# Altium schematic sheet power_cpu.SchDoc
size A3
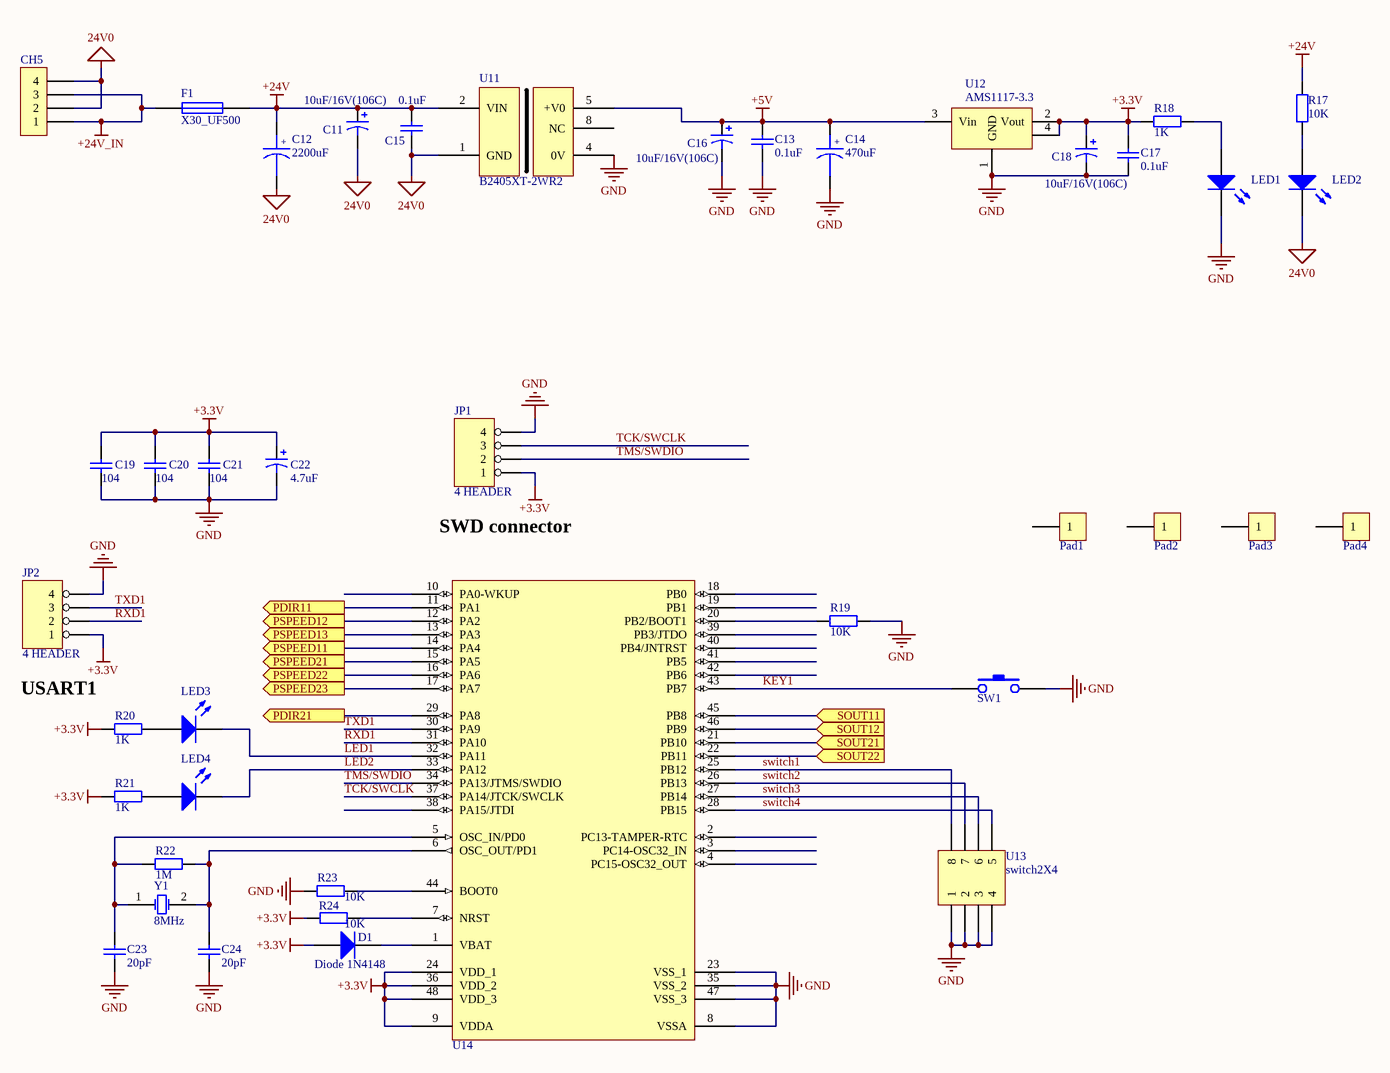
[diagram p0: power_cpu.SchDoc]

## Parts
C11  value 10uF/16V(106C)  [CAP A-3216]  (hidden comment: Cap Pol3)
C12  C_2200uF  [C7.8*17]  (value not drawn)
C13  value 0.1uF  [0805]  (hidden comment: Cap)
C14  C_2200uF  [C5*10]  (value not drawn)
C15  value 0.1uF  [0805]  (hidden comment: Cap)
C16  value 10uF/16V(106C)  [CAP A-3216]  (hidden comment: Cap Pol3)
C17  value 0.1uF  [0805]  (hidden comment: Cap)
C18  value 10uF/16V(106C)  [CAP A-3216]  (hidden comment: Cap Pol3)
C19  value 104  [C0805tan]  (hidden comment: Cap)
C20  value 104  [C0805tan]  (hidden comment: Cap)
C21  value 104  [C0805tan]  (hidden comment: Cap)
C22  value 4.7uF  [3225[1210]]  (hidden comment: Cap Pol1)
C23  value 20pF  [C0805tan]  (hidden comment: Cap)
C24  value 20pF  [C0805tan]  (hidden comment: Cap)
CH5  HEADER1X4  [CH3.96-4PIN]  (value not drawn)
D1  Diode 1N4148  [LL34]
F1  X30_UF500  [X30UF600]
JP1  4 HEADER  [CON4_1.5]
JP2  4 HEADER  [HDR1X4]
LED1  (no value)  [LED-0805]
LED2  (no value)  [LED-0805]
LED3  (no value)  [LED-0805]
LED4  (no value)  [LED-0805]
Pad1  Pad  [pad35]  (value not drawn)
Pad2  Pad  [pad35]  (value not drawn)
Pad3  Pad  [pad35]  (value not drawn)
Pad4  Pad  [pad35]  (value not drawn)
R17  value 10K  [0805]  (hidden comment: Res2)
R18  value 1K  [0805]  (hidden comment: Res2)
R19  value 10K  [C0805tan]  (hidden comment: Res2)
R20  value 1K  [0805]  (hidden comment: Res2)
R21  value 1K  [0805]  (hidden comment: Res2)
R22  value 1M  [C0805tan]  (hidden comment: Res2)
R23  value 10K  [C0805tan]  (hidden comment: Res2)
R24  value 10K  [C0805tan]  (hidden comment: Res2)
SW1  SW-KEY-2  [KEY_SOP4]  (value not drawn)
U11  B2405XT-2WR2  [B2405XT-2WR2]
U12  AMS1117-3.3  [SOT223]
U13  switch2X4  [SOP8_switch]
U14  STM32F103C8T6  [LQFP48]  (value not drawn)
Y1  8MHz  [XTAL_US]

## Ports
PDIR11 (out), PDIR21 (out), PSPEED11 (out), PSPEED12 (out), PSPEED13 (out), PSPEED21 (out), PSPEED22 (out), PSPEED23 (out), SOUT11 (in), SOUT12 (in), SOUT21 (in), SOUT22 (in)

## Nets
24V0: C11.2 C12.2 C15.1 CH5.2 CH5.4 LED2.2(K) U11.1(GND)
+3.3V: C17.2 C18.1 C19.2 C20.2 C21.2 C22.1 D1.1(A) JP1.1 JP2.1 R18.2 R20.2 R21.2 R24.1 U12.2(Vout) U12.4 U14.9(VDDA) U14.24(VDD_1) U14.36(VDD_2) U14.48(VDD_3)
+5V: C13.2 C14.1 C16.1 U11.5(+V0) U12.3(Vin)
+24V: C11.1 C12.1 C15.2 F1.2 R17.2 U11.2(VIN)
+24V_IN: CH5.1 CH5.3 F1.1
GND: C13.1 C14.2 C16.2 C17.1 C18.2 C19.1 C20.1 C21.1 C22.2 C23.1 C24.1 JP1.4 JP2.4 LED1.2(K) R19.2 R23.1 SW1.2 U11.4(0V) U12.1(GND) U13.1 U13.2 U13.3 U13.4 U14.8(VSSA) U14.23(VSS_1) U14.35(VSS_2) U14.47(VSS_3)
KEY1: SW1.1 U14.43(PB7)
LED1: LED3.2(K) U14.32(PA11)
LED2: LED4.2(K) U14.33(PA12)
PDIR11: U14.11(PA1) ; port PDIR11
PDIR21: U14.29(PA8) ; port PDIR21
PSPEED11: U14.14(PA4) ; port PSPEED11
PSPEED12: U14.12(PA2) ; port PSPEED12
PSPEED13: U14.13(PA3) ; port PSPEED13
PSPEED21: U14.15(PA5) ; port PSPEED21
PSPEED22: U14.16(PA6) ; port PSPEED22
PSPEED23: U14.17(PA7) ; port PSPEED23
RXD1: JP2.2 U14.31(PA10)
SOUT11: U14.45(PB8) ; port SOUT11
SOUT12: U14.46(PB9) ; port SOUT12
SOUT21: U14.21(PB10) ; port SOUT21
SOUT22: U14.22(PB11) ; port SOUT22
switch1: U13.8 U14.25(PB12)
switch2: U13.7 U14.26(PB13)
switch3: U13.6 U14.27(PB14)
switch4: U13.5 U14.28(PB15)
TCK/SWCLK: JP1.3 U14.37(PA14/JTCK/SWCLK)
TMS/SWDIO: JP1.2 U14.34(PA13/JTMS/SWDIO)
TXD1: JP2.3 U14.30(PA9)
NetC23_2: C23.2 R22.1 U14.5(OSC_IN/PD0) Y1.1(OSC1)
NetC24_2: C24.2 R22.2 U14.6(OSC_OUT/PD1) Y1.2(OSC2)
NetD1_2: D1.2(K) U14.1(VBAT)
NetLED1_1: LED1.1(A) R18.1
NetLED2_1: LED2.1(A) R17.1
NetLED3_1: LED3.1(A) R20.1
NetLED4_1: LED4.1(A) R21.1
NetR19_1: R19.1 U14.20(PB2/BOOT1)
NetR23_2: R23.2 U14.44(BOOT0)
NetR24_2: R24.2 U14.7(NRST)

Not connected (* = marked no-connect by the designer): Pad1 1; Pad2 1; Pad3 1; Pad4 1; U11 8(NC); U14 2(PC13-TAMPER-RTC) 3(PC14-OSC32_IN) 4(PC15-OSC32_OUT) 10(PA0-WKUP) 18(PB0) 19(PB1) 38(PA15/JTDI) 39(PB3/JTDO) 40(PB4/JNTRST) 41(PB5) 42(PB6)

## Notes on the sheet
- SWD connector
- USART1
- (in symbol C_2200uF) +; 2200uF; 470uF

## Library data of the parts
C11 C16 C18 = Cap Pol3: Polarized Capacitor (Surface Mount); Published: 8-Jun-2000; LatestRevisionDate: 17-Jul-2002; LatestRevisionNote: Re-released for DXP Platform.; PackageReference: C0805; Publisher: Altium Limited
C13 C15 C17 C19-C21 C23 C24 = Cap: Capacitor; Published: 8-Jun-2000; LatestRevisionDate: 17-Jul-2002; LatestRevisionNote: Re-released for DXP Platform.; Publisher: Altium Limited
  C13 C15 C17 C19-C21: PackageReference: RAD-0.3
C22 = Cap Pol1: Polarized Capacitor (Radial); Published: 8-Jun-2000; LatestRevisionDate: 17-Jul-2002; LatestRevisionNote: Re-released for DXP Platform.; PackageReference: RB7.6-15; Publisher: Altium Limited
D1 = Diode 1N4148: High Conductance Fast Diode; Published: 8-Jun-2000; LatestRevisionDate: 17-Jul-2002; LatestRevisionNote: Re-released for DXP Platform.; DatasheetDocument: 1997; PackageReference: DO-35; Publisher: Altium Limited; Code_JEDEC: DO-204-AH; ComponentLink1Description: Manufacturer Link; ComponentLink1URL: http://www.fairchildsemi.com/; ComponentLink2Description: Datasheet; ComponentLink2URL: http://www.fairchildsemi.com/ds/1N%2F1N4148.pdf
F1 = Fuse 1: Fuse; Published: 8-Jun-2000; LatestRevisionDate: 17-Jul-2002; LatestRevisionNote: Re-released for DXP Platform.; PackageReference: PIN-W2/E2.8; Publisher: Altium Limited
JP1 JP2 = 4 HEADER: 4 Pin Header
LED1-LED4 = LED2: Typical RED, GREEN, YELLOW, AMBER GaAs LED; Published: 8-Jun-2000; LatestRevisionDate: 17-Jul-2002; LatestRevisionNote: Re-released for DXP Platform.; PackageDocument: Feb-2002; PackageReference: 3.2X1.6X1.1; Publisher: Altium Limited
R17-R24 = Res2: Resistor; Published: 8-Jun-2000; LatestRevisionDate: 17-Jul-2002; LatestRevisionNote: Re-released for DXP Platform.; Publisher: Altium Limited
  R17 R18 R20 R21: PackageReference: AXIAL-0.4
U12 = AMS1117-5
Y1 = XTAL: Crystal Oscillator; Published: 8-Jun-2000; LatestRevisionDate: 17-Jul-2002; LatestRevisionNote: Re-released for DXP Platform.; Publisher: Altium Limited